# EAGLE schematic RF-PCB (EAGLE 6.3)

## Sheet 1 of 4: RPI
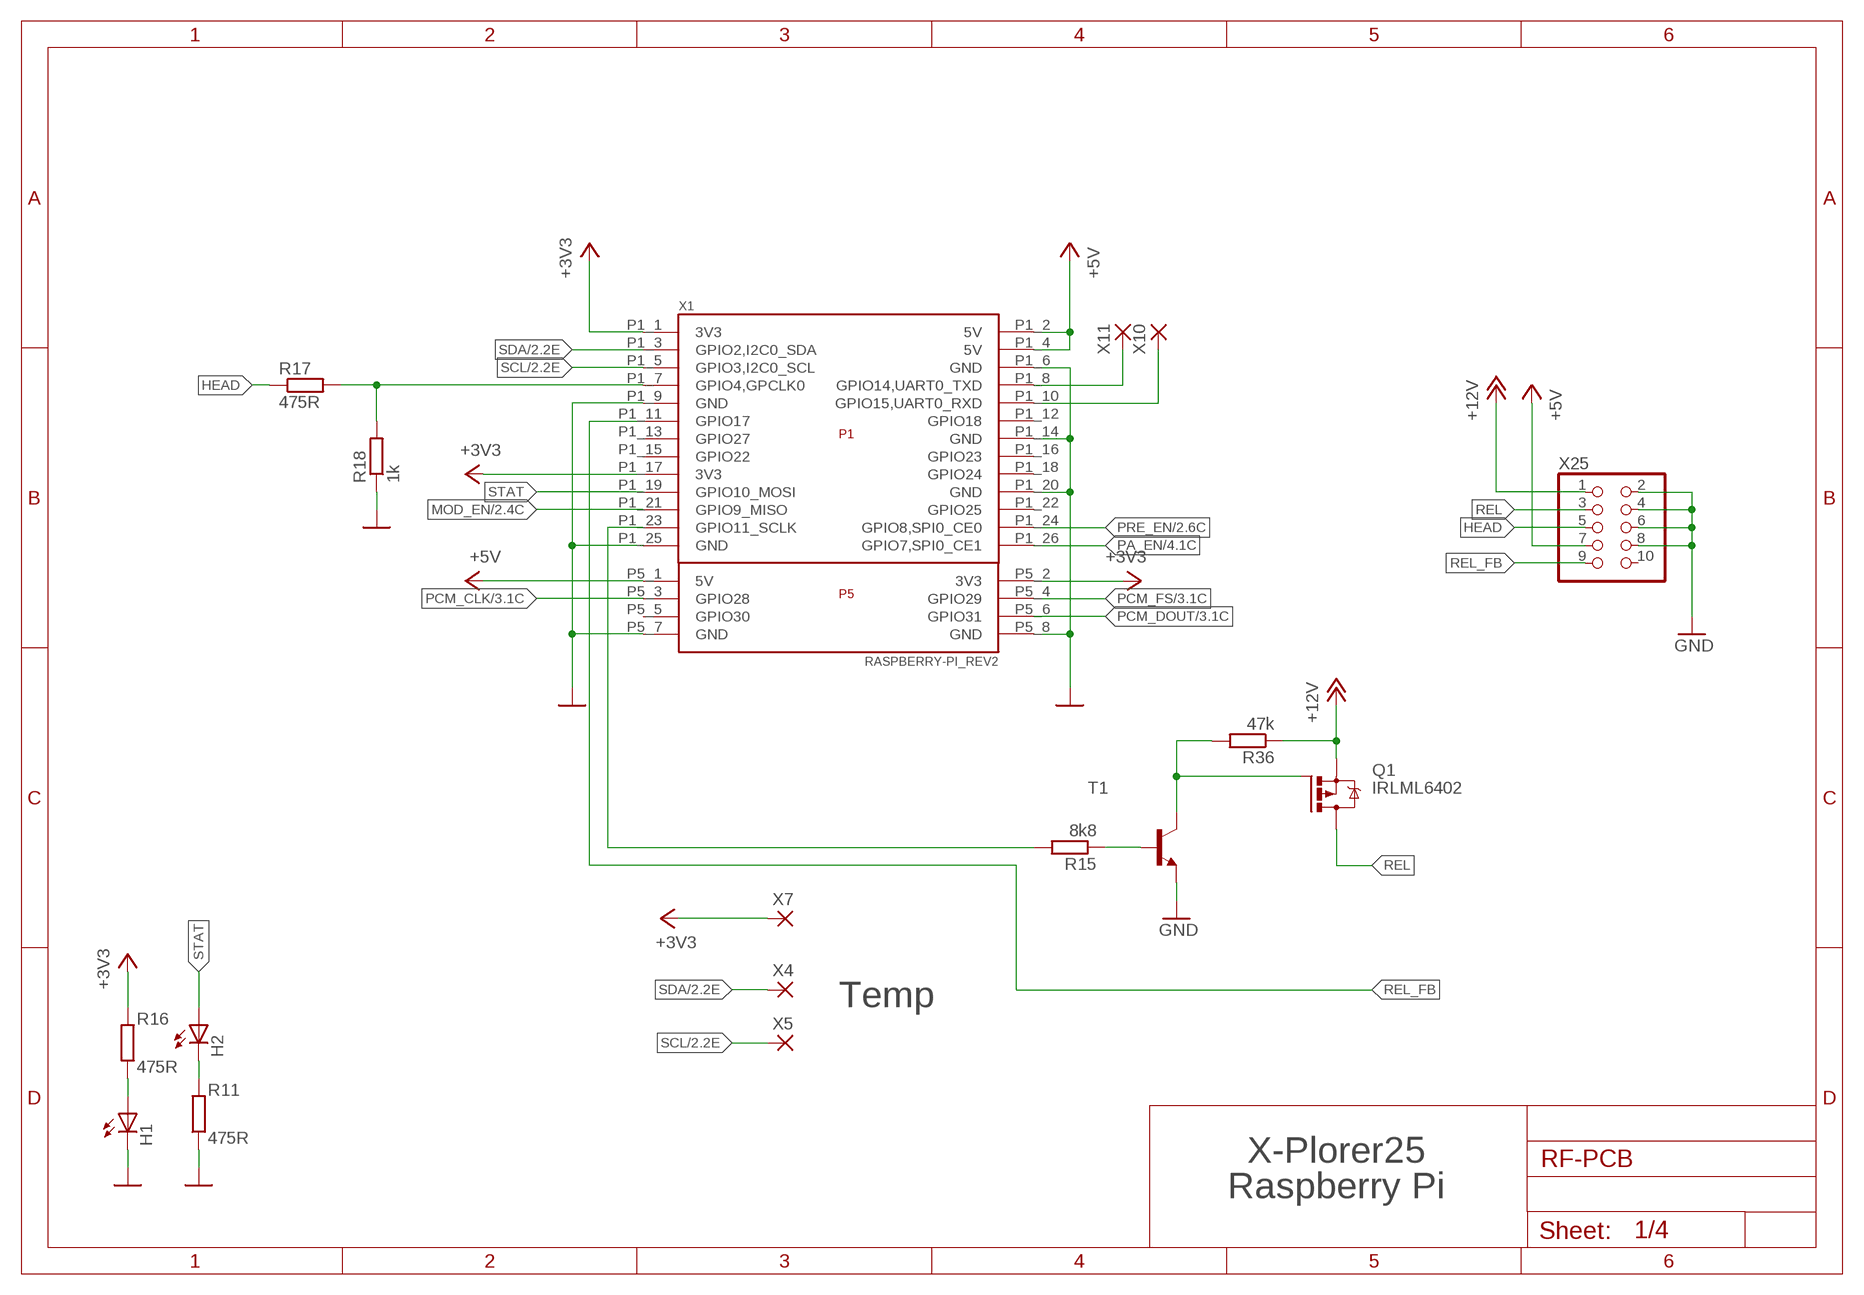
[diagram p0: schematic, sheet 1]

### Parts
H1  PL006-WCR12  [SOT23]
H2  PL006-WCR12  [SOT23]
Q1  IRLML6402  IRLML5203  [MICRO3]
R11  475R  R-EU_R0603  [R0603]
R15  8k8  R-EU_R0603  [R0603]
R16  475R  R-EU_R0603  [R0603]
R17  475R  R-EU_R0603  [R0603]
R18  1k  R-EU_R0603  [R0603]
R36  47k  R-EU_R0603  [R0603]
T1  BC817-16-NPN-SOT23-BEC  [SOT23-BEC]
X1  RASPBERRY-PI_REV2  [RASPBERRY-PI_REV2]
X4  SMD2  [SMD1,27-2,54]
X5  SMD2  [SMD1,27-2,54]
X7  SMD2  [SMD1,27-2,54]
X10  SMD2  [SMD1,27-2,54]
X11  SMD2  [SMD1,27-2,54]
X25  PINHD-2X5  [2X05]

### Nets
+3V3: R16.2 X1.P1_1(3V3) X1.P1_17(3V3) X1.P5_2(3V3) X7.1(P) ; also sheet 2
+5V: X1.P1_2(5V) X1.P1_4(5V) X1.P5_1(5V) X25.7 ; also sheet 2,3,4
+12V: Q1.2(S) R36.1 X25.1 ; also sheet 2,4
GND: H1.3(C) R11.1 R18.1 T1.E X1.P1_6(GND) X1.P1_9(GND) X1.P1_14(GND) X1.P1_20(GND) X1.P1_25(GND) X1.P5_7(GND) X1.P5_8(GND) X25.2 X25.4 X25.6 X25.8 ; also sheet 2,3,4
HEAD: R17.1 X25.5
MOD_EN: X1.P1_21(GPIO9_MISO) ; also sheet 2
N$16: H2.3(C) R11.2
N$18: H1.1(A) R16.1
N$27: R17.2 R18.2 X1.P1_7(GPIO4,GPCLK0)
N$29: X1.P1_10(GPIO15,UART0_RXD) X10.1(P)
N$42: R15.1 T1.B
N$54: Q1.1(G) R36.2 T1.C
N$57: X1.P1_8(GPIO14,UART0_TXD) X11.1(P)
N$66: R15.2 X1.P1_23(GPIO11_SCLK)
PA_EN: X1.P1_26(GPIO7,SPI0_CE1) ; also sheet 4
PCM_CLK: X1.P5_3(GPIO28) ; also sheet 3
PCM_DOUT: X1.P5_6(GPIO31) ; also sheet 3
PCM_FS: X1.P5_4(GPIO29) ; also sheet 3
PRE_EN: X1.P1_24(GPIO8,SPI0_CE0) ; also sheet 2
REL: Q1.3(D) X25.3
REL_FB: X1.P1_11(GPIO17) X25.9
SCL: X1.P1_5(GPIO3,I2C0_SCL) X5.1(P) ; also sheet 2
SDA: X1.P1_3(GPIO2,I2C0_SDA) X4.1(P) ; also sheet 2
STAT: H2.1(A) X1.P1_19(GPIO10_MOSI)
Unconnected: X1.P1_12(GPIO18) X1.P1_13(GPIO27) X1.P1_15(GPIO22) X1.P1_16(GPIO23) X1.P1_18(GPIO24) X1.P1_22(GPIO25) X1.P5_5(GPIO30) X25.10

### Notes on the sheet
- Temp
- X-Plorer25
- Raspberry Pi

## Sheet 2 of 4: IQ
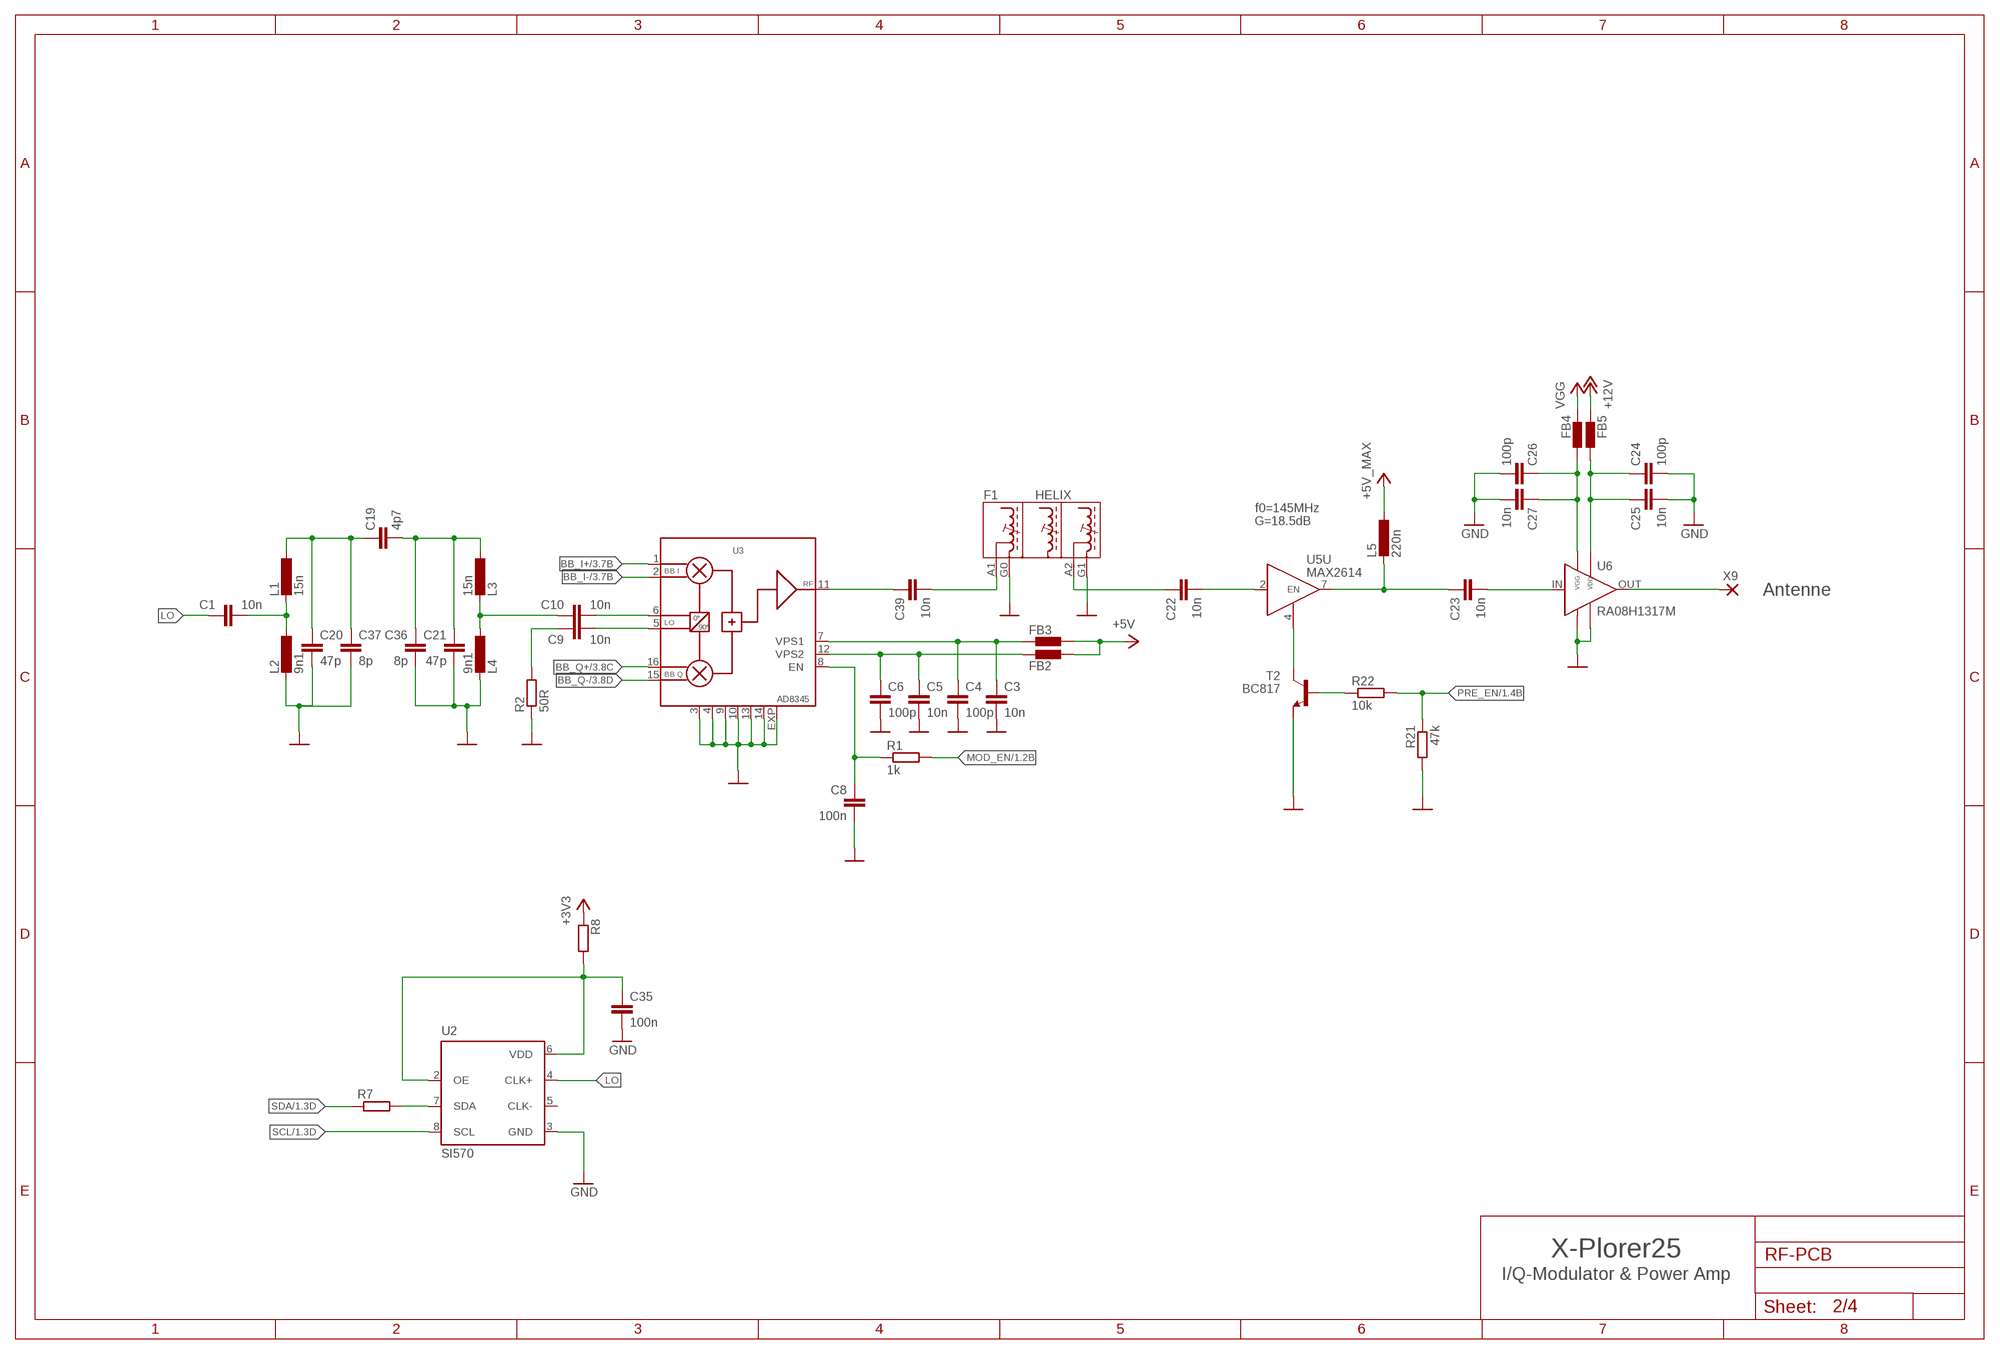
[diagram p1: schematic, sheet 2]

### Parts
C1  10n  C-EUC0603  [C0603]
C3  10n  C-EUC0603  [C0603]
C4  100p  C-EUC0603  [C0603]
C5  10n  C-EUC0603  [C0603]
C6  100p  C-EUC0603  [C0603]
C8  100n  C-EUC0603  [C0603]
C9  10n  C-EUC0603  [C0603]
C10  10n  C-EUC0603  [C0603]
C19  4p7  C-EUC0603  [C0603]
C20  47p  C-EUC0805K  [C0805K]
C21  47p  C-EUC0805K  [C0805K]
C22  10n  C-EUC0603  [C0603]
C23  10n  C-EUC0603  [C0603]
C24  100p  C-EUC0603  [C0603]
C25  10n  C-EUC0603  [C0603]
C26  100p  C-EUC0603  [C0603]
C27  10n  C-EUC0603  [C0603]
C35  100n  C-0603  [0603]
C36  8p  C-EUC0805K  [C0805K]
C37  8p  C-EUC0805K  [C0805K]
C39  10n  C-EUC0603  [C0603]
F1  HELIX  [CBT13]
FB2  BML15H  [R0603]
FB3  BML15H  [R0603]
FB4  BML15H  [R0603]
FB5  BML15H  [R0603]
L1  15n  L-EUL2012C  [L2012C]
L2  9n1  L-EUL2012C  [L2012C]
L3  15n  L-EUL2012C  [L2012C]
L4  9n1  L-EUL2012C  [L2012C]
L5  220n  L-EUL2012C  [L2012C]
R1  1k  R-EU_R0603  [R0603]
R2  50R  R-EU_R0603  [R0603]
R7  R-EU_R0603  [R0603]
R8  R-EU_R2010  [R2010]
R21  47k  R-EU_R0603  [R0603]
R22  10k  R-EU_R0603  [R0603]
T2  BC817  BC817-16LT1SMD  [SOT23-BEC]
U2  SI570  [8-PIN]
U3  AD8345  [TSSOP16EXP]
U5  MAX2614  MAX2615  [TDFN8-2X3MM]
U6  RA08H1317M  [RA08H1317M]
X9  SMD2  [SMD1,27-2,54]

### Nets
+3V3: R8.1 ; also sheet 1
+5V: FB2.2 FB3.2 ; also sheet 1,3,4
+5V_MAX: L5.1 ; also sheet 4
+12V: FB5.1 ; also sheet 1,4
BB_I+: U3.1(BB_I) ; also sheet 3
BB_I-: U3.2(!BB_I) ; also sheet 3
BB_Q+: U3.16(BB_Q) ; also sheet 3
BB_Q-: U3.15(!BB_Q) ; also sheet 3
CLEAN_LO: C10.1 L3.2 L4.1
GND: C3.2 C4.2 C5.2 C6.2 C8.2 C20.2 C21.2 C24.2 C25.2 C26.2 C27.2 C35.2 C36.2 C37.2 F1.G0(GND) F1.G1(GND) L2.2 L4.2 R2.1 R21.2 T2.E U2.3(GND) U3.3(GND) U3.4(GND) U3.9(GND) U3.10(GND) U3.13(GND) U3.14(GND) U3.EXP(GND) U6.G1(GND) U6.G2(GND) ; also sheet 1,3,4
LO: C1.1 U2.4(CLK+)
MOD_EN: R1.2 ; also sheet 1
N$1: C39.2 F1.A1
N$2: C10.2 U3.6(LO)
N$3: C3.1 C4.1 FB3.1 U3.7(VPS1)
N$4: C5.1 C6.1 FB2.1 U3.12(VPS2)
N$5: C8.1 R1.1 U3.8(EN)
N$6: C9.2 U3.5(!LO)
N$7: C9.1 R2.2
N$8: C39.1 U3.11(RF)
N$13: R7.2 U2.7(SDA)
N$14: C19.2 C21.1 C36.1 L3.1
N$15: C22.1 F1.A2
N$17: C1.2 L1.2 L2.1
N$19: C35.1 R8.2 U2.2(OE) U2.6(VDD)
N$20: C22.2 U5.2(U:IN)
N$21: C23.1 L5.2 U5.7(U:OUT)
N$22: C23.2 U6.IN
N$23: C24.1 C25.1 FB5.2 U6.VDD
N$24: C26.1 C27.1 FB4.2 U6.VGG
N$26: U6.OUT X9.1(P)
N$40: T2.C U5.4(U:EN)
N$41: R22.1 T2.B
PRE_EN: R21.1 R22.2 ; also sheet 1
SCL: U2.8(SCL) ; also sheet 1
SDA: R7.1 ; also sheet 1
VGG: FB4.1 ; also sheet 4
VLA: C19.1 C20.1 C37.1 L1.1
Unconnected: U2.5(CLK-)

### Notes on the sheet
- f0=145MHz
- G=18.5dB
- Antenne
- X-Plorer25
- I/Q-Modulator & Power Amp

## Sheet 3 of 4: BB
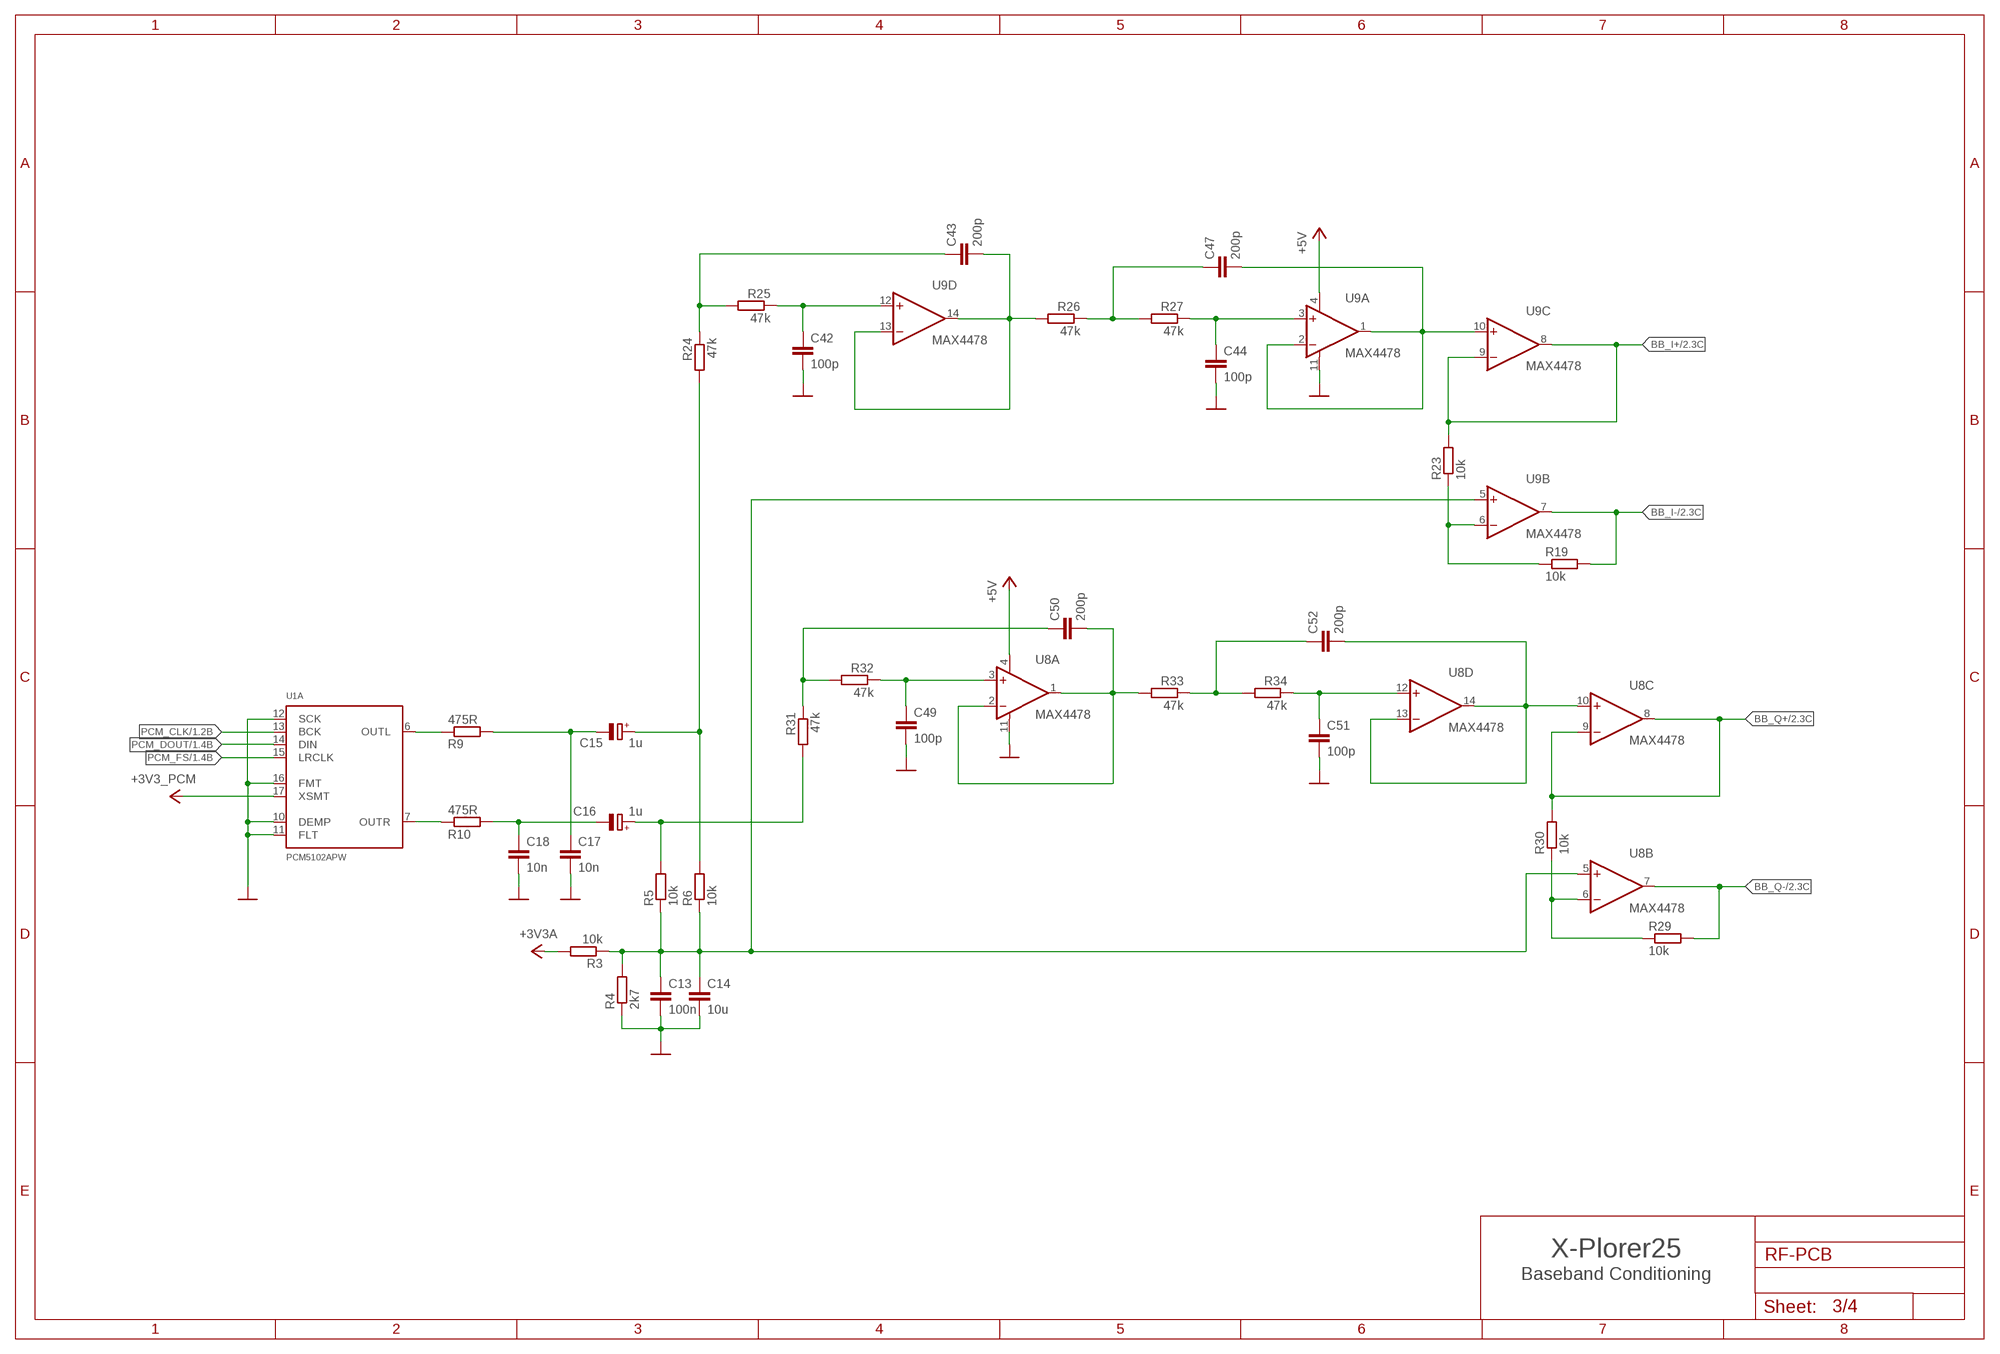
[diagram p2: schematic, sheet 3]

### Parts
C13  100n  C-EUC0603  [C0603]
C14  10u  C-EUC0603  [C0603]
C15  1u  CPOL-EUCT3528  [CT3528]
C16  1u  CPOL-EUCT3528  [CT3528]
C17  10n  C-EUC0603  [C0603]
C18  10n  C-EUC0603  [C0603]
C42  100p  C-EUC0603  [C0603]
C43  200p  C-EUC0805  [C0805]
C44  100p  C-EUC0603  [C0603]
C47  200p  C-EUC0805  [C0805]
C49  100p  C-EUC0603  [C0603]
C50  200p  C-EUC0805  [C0805]
C51  100p  C-EUC0603  [C0603]
C52  200p  C-EUC0805  [C0805]
R3  10k  R-EU_R0603  [R0603]
R4  2k7  R-EU_R0603  [R0603]
R5  10k  R-EU_R0603  [R0603]
R6  10k  R-EU_R0603  [R0603]
R9  475R  R-EU_R0603  [R0603]
R10  475R  R-EU_R0603  [R0603]
R19  10k  R-EU_R0603  [R0603]
R23  10k  R-EU_R0603  [R0603]
R24  47k  R-EU_R0603  [R0603]
R25  47k  R-EU_R0603  [R0603]
R26  47k  R-EU_R0603  [R0603]
R27  47k  R-EU_R0603  [R0603]
R29  10k  R-EU_R0603  [R0603]
R30  10k  R-EU_R0603  [R0603]
R31  47k  R-EU_R0603  [R0603]
R32  47k  R-EU_R0603  [R0603]
R33  47k  R-EU_R0603  [R0603]
R34  47k  R-EU_R0603  [R0603]
U1  PCM5102APW  [PW_R-PDSO-G20]
U8  MAX4478  OPA4132U  [SO14]
U9  MAX4478  OPA4132U  [SO14]

### Nets
$2345: C16.+ R5.2 R31.2
$123456: C15.+ R6.2 R24.2
+3V3_PCM: U1.17(A:XSMT) ; also sheet 4
+3V3A: R3.2 ; also sheet 4
+5V: U8.4(A:V+) U9.4(A:V+) ; also sheet 1,2,4
BB_I+: R23.2 U9.8(C:OUT) U9.9(C:-IN) ; also sheet 2
BB_I-: R19.2 U9.7(B:OUT) ; also sheet 2
BB_Q+: R30.2 U8.8(C:OUT) U8.9(C:-IN) ; also sheet 2
BB_Q-: R29.2 U8.7(B:OUT) ; also sheet 2
GND: C13.2 C14.2 C17.2 C18.2 C42.2 C44.2 C49.2 C51.2 R4.1 U1.10(A:DEMP) U1.11(A:FLT) U1.12(A:SCK) U1.16(A:FMT) U8.11(A:V-) U9.11(A:V-) ; also sheet 1,2,4
N$9: C49.1 R32.1 U8.3(A:+IN)
N$10: R10.1 U1.7(A:OUTR)
N$11: C16.- C18.1 R10.2
N$12: R9.1 U1.6(A:OUTL)
N$32: C50.1 R31.1 R32.2
N$37: C52.2 U8.10(C:+IN) U8.13(D:-IN) U8.14(D:OUT)
N$38: C51.1 R34.1 U8.12(D:+IN)
N$39: C52.1 R33.1 R34.2
N$43: C42.1 R25.1 U9.12(D:+IN)
N$46: C43.1 R24.1 R25.2
N$47: C47.2 U9.1(A:OUT) U9.2(A:-IN) U9.10(C:+IN)
N$48: C44.1 R27.1 U9.3(A:+IN)
N$49: C47.1 R26.1 R27.2
N$50: C43.2 R26.2 U9.13(D:-IN) U9.14(D:OUT)
N$51: C50.2 R33.2 U8.1(A:OUT) U8.2(A:-IN)
N$52: R19.1 R23.1 U9.6(B:-IN)
N$53: R29.1 R30.1 U8.6(B:-IN)
N$64: C15.- C17.1 R9.2
PCM_CLK: U1.13(A:BCK) ; also sheet 1
PCM_DOUT: U1.14(A:DIN) ; also sheet 1
PCM_FS: U1.15(A:LRCLK) ; also sheet 1
VGND: C13.1 C14.1 R3.1 R4.2 R5.1 R6.1 U8.5(B:+IN) U9.5(B:+IN)

### Notes on the sheet
- X-Plorer25
- Baseband Conditioning

## Sheet 4 of 4: PWR
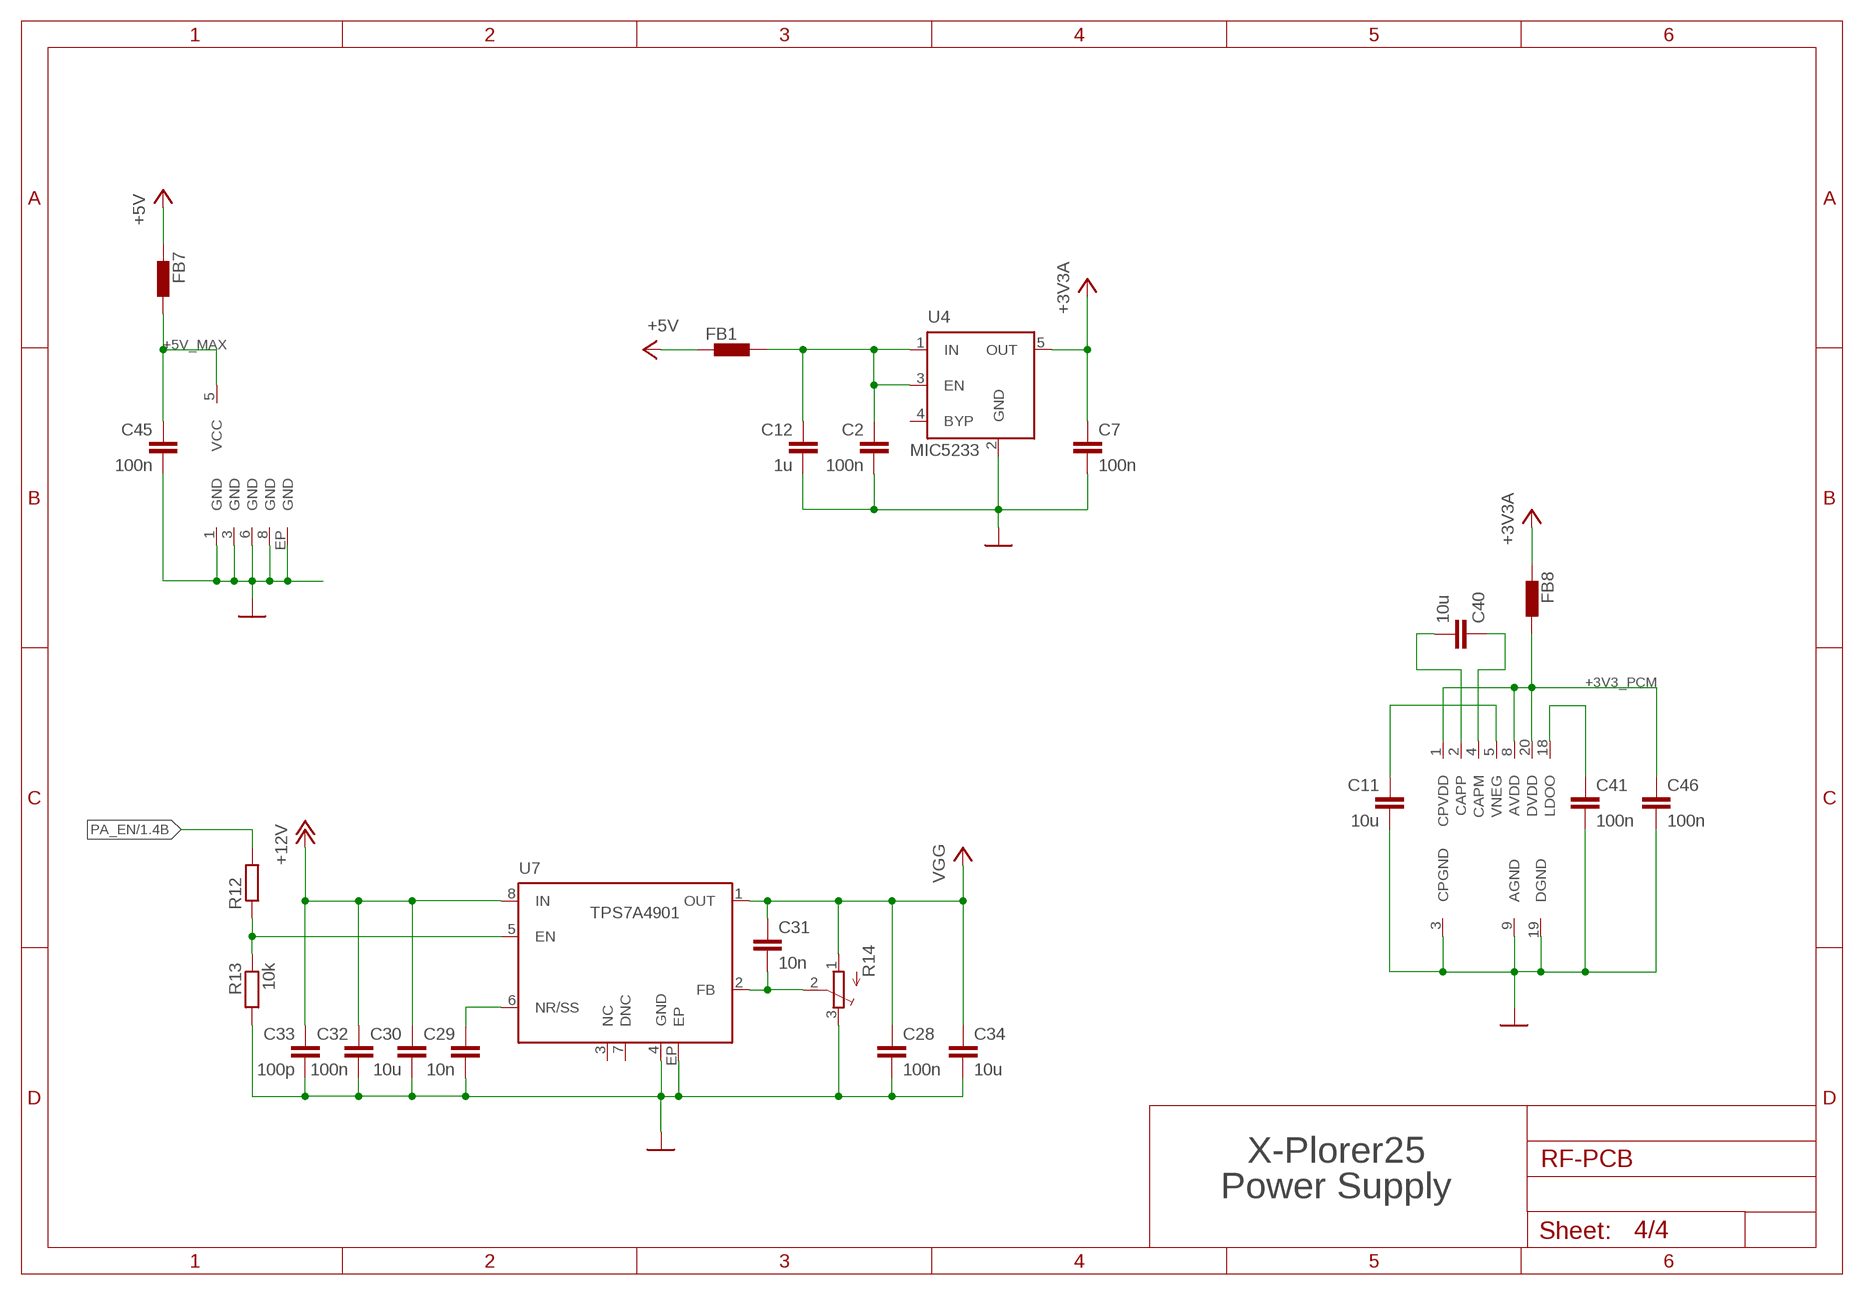
[diagram p3: schematic, sheet 4]

### Parts
C2  100n  C-EUC0603  [C0603]
C7  100n  C-EUC0603  [C0603]
C11  10u  C-EUC0805  [C0805]
C12  1u  C-EUC0603  [C0603]
C28  100n  C-EUC0603  [C0603]
C29  10n  C-EUC0603K  [C0603K]
C30  10u  C-EUC0805  [C0805]
C31  10n  C-EUC0603  [C0603]
C32  100n  C-EUC0603  [C0603]
C33  100p  C-EUC0603  [C0603]
C34  10u  C-EUC0805  [C0805]
C40  10u  C-EUC0805  [C0805]
C41  100n  C-EUC0603  [C0603]
C45  100n  C-EUC0603  [C0603]
C46  100n  C-EUC0603  [C0603]
FB1  BML15H  [R0603]
FB7  BML15H  [R0603]
FB8  BML15H  [R0603]
R12  R-EU_R0603  [R0603]
R13  10k  R-EU_R0603  [R0603]
R14  TRIM_EU-SM-42/43X  [SM-42/43X]
U4  MIC5233  MIC5219XX  [SOT23-5]
U7  TPS7A4901  [PW_R-PDSO-G08]

### Nets
12V_F: C2.1 C12.1 FB1.2 U4.1(IN) U4.3(EN)
+3V3_PCM: C46.1 FB8.2 U1.1(P:CPVDD) U1.8(P:AVDD) U1.20(P:DVDD) ; also sheet 3
+3V3A: C7.1 FB8.1 U4.5(OUT) ; also sheet 3
+5V: FB1.1 FB7.1 ; also sheet 1,2,3
+5V_MAX: C45.1 FB7.2 U5.5(P:VCC) ; also sheet 2
+12V: C30.1 C32.1 C33.1 U7.8(IN) ; also sheet 1,2
GND: C2.2 C7.2 C11.2 C12.2 C28.2 C29.2 C30.2 C32.2 C33.2 C34.2 C41.2 C45.2 C46.2 R13.2 R14.3(E) U1.3(P:CPGND) U1.9(P:AGND) U1.19(P:DGND) U4.2(GND) U5.1(P:GND) U5.3(P:GND) U5.6(P:GND) U5.8(P:GND) U5.EP(P:GND) U7.4(GND) U7.EP ; also sheet 1,2,3
N$25: R12.1 R13.1 U7.5(EN)
N$28: C31.2 R14.2(S) U7.2(FB)
N$33: C11.1 U1.5(P:VNEG)
N$34: C40.1 U1.4(P:CAPM)
N$35: C40.2 U1.2(P:CAPP)
N$36: C41.1 U1.18(P:LDOO)
N$44: C29.1 U7.6(NR/SS)
PA_EN: R12.2 ; also sheet 1
VGG: C28.1 C31.1 C34.1 R14.1(A) U7.1(OUT) ; also sheet 2
Unconnected: U4.4(BYP) U7.3(NC) U7.7(DNC)

### Notes on the sheet
- X-Plorer25
- Power Supply

## Library data of the parts
C1-C14 C17-C34 C36 C37 C39-C47 C49-C52 = rcl:C-EU: CAPACITOR, European symbol
C15 C16 = rcl:CPOL-EU: POLARIZED CAPACITOR, European symbol
C35 = RC:C
F1 = 272MT-1008A:HELIX
FB1-FB5 FB7 FB8 = FB:BML15H: EMIFIL (R) Chip Ferrite Bead for GHz Noise Source: http://www.murata.com/ Ferrite Bead BLM15H.pdf
H1 H2 = led:PL006*: PLH006 Series SMD LED SOT23 PLH006-WCR21 Super Red PLH006-WCR12 High Eff Red PLH006-WCG13 Green PLH006-WCY01 Yellow www.p-tec.net Source: http://www.wittig-electronic.de/PTEC/PL006Series.pdf
L1-L5 = rcl:L-EU: INDUCTOR, European symbol
Q1 = transistor-power:IRLML5203: HEXFET P-Channel Power MOSFET
R1-R13 R15-R19 R21-R27 R29-R34 R36 = rcl:R-EU_: RESISTOR, European symbol
R14 = pot:TRIM_EU-: POTENTIOMETER
T1 = transistor:*-NPN-: NPN Transistror BF959 corrected 2008.03.06
T2 = transistor-npn:BC817*: NPN Transistor
U1 = PCM5102A:PCM5102A
U2 = silabs:SI570: ANY-RATE I2C PROGRAMMABLE XO/VCXO Source: si570.pdf; OC_FARNELL: unknown; OC_NEWARK: unknown
U3 = AD8345:AD8345
U4 = v-reg-micrel:MIC5219XX: VOLTAGE REGULATOR; OC_FARNELL: unknown; OC_NEWARK: unknown
U5 = MAX2615:MAX2615
U6 = RA08H1317M:RA08H1317M
U7 = TPS7A4901:TPS7A4901
U8 U9 = burr-brown:OPA4132: High Speed FET-Input Operational Amplifiers; MF: TEXAS INSTRUMENTS; MPN: OPA4132UA; OC_FARNELL: 1212302; OC_NEWARK: 80K6028
X1 = RaspberryPi_v2:RASPBERRY-PI_REV2: Raspberry Pi Board <http://www.raspberrypi.org/> Jacques Lagnel V1.0 (beta) 2012 Mateusz Bawaj V1.1 (beta) 2012 Board dimension: Forum 3D model <http://www.raspberrypi.org/forum/general-discussion/mechanical-profile-3d-models?value=3d%20model&type=1&include=1&search=1&ret=all> The GPIO Connector (P1): http://elinux.org/RPi_Low-level_peripherals The GPIO Connector (P5): http://www.raspberrypi-spy.co.uk/2012/09/raspberry-pi-p5-header/
X4 X5 X7 X9-X11 = wirepad:SMD2: SMD PAD
X25 = pinhead:PINHD-2X5: PIN HEADER